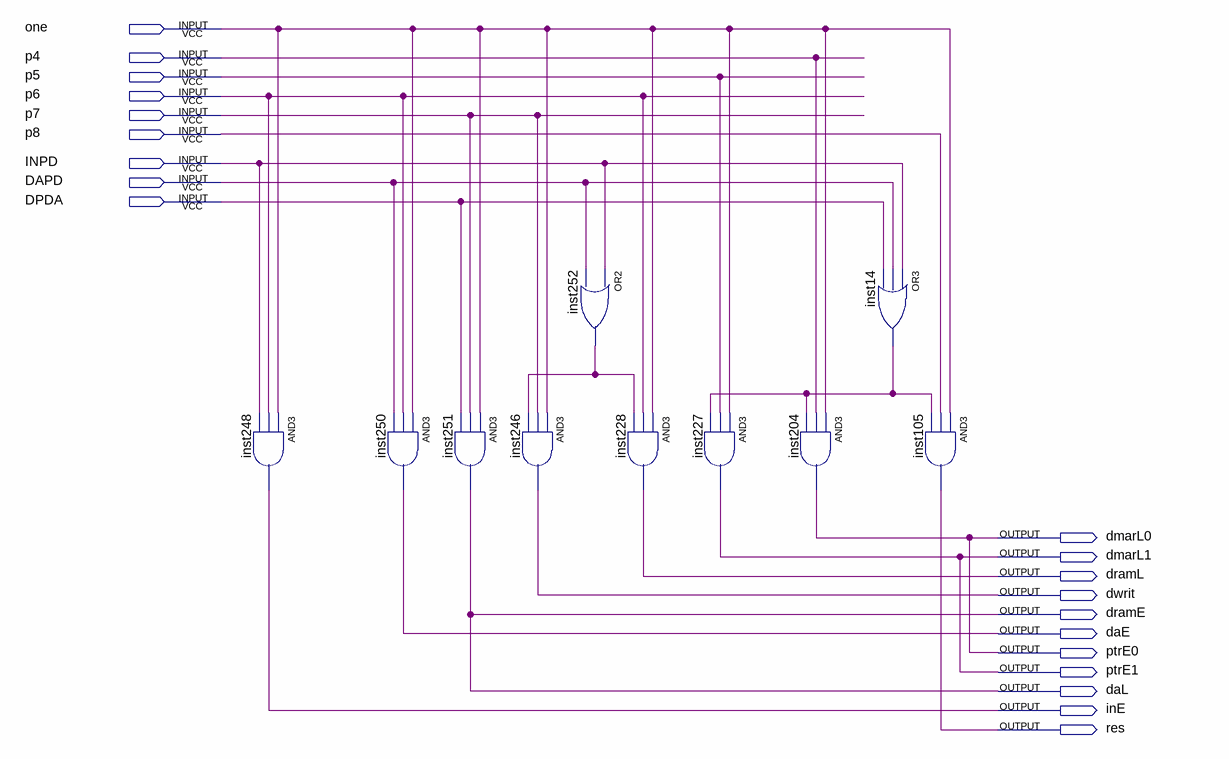
[diagram p0: schematic sheet]
// Quartus schematic kzjz_a.bdf as structural Verilog: 10 symbols, 20 pins
module kzjz_a (
  input  one,
  input  p4,
  input  p5,
  input  p6,
  input  p7,
  input  p8,
  input  INPD,
  input  DAPD,
  input  DPDA,
  output dmarL0,
  output dmarL1,
  output dramL,
  output dwrit,
  output dramE,
  output daE,
  output ptrE0,
  output ptrE1,
  output daL,
  output inE,
  output res
);

  wire inst14_out, inst252_out;

  and inst248 (inE, one, p6, INPD);
  and inst250 (daE, one, p6, DAPD);
  and inst251 (daL, one, p7, DPDA);
  or inst252 (inst252_out, INPD, DAPD);
  and inst246 (dwrit, one, p7, inst252_out);
  and inst228 (dramL, one, p6, inst252_out);
  and inst227 (dmarL1, one, p5, inst14_out);
  and inst204 (dmarL0, one, p4, inst14_out);
  or inst14 (inst14_out, INPD, DAPD, DPDA);
  and inst105 (res, one, p8, inst14_out);

  assign dramE = daL;
  assign ptrE0 = dmarL0;
  assign ptrE1 = dmarL1;
endmodule
